# Altium schematic sheet HEADERS.SchDoc: Timing Controller Daughter Board; Memory & Crystal & Clock Synthesizer
size C; DrawnBy: A. Hood
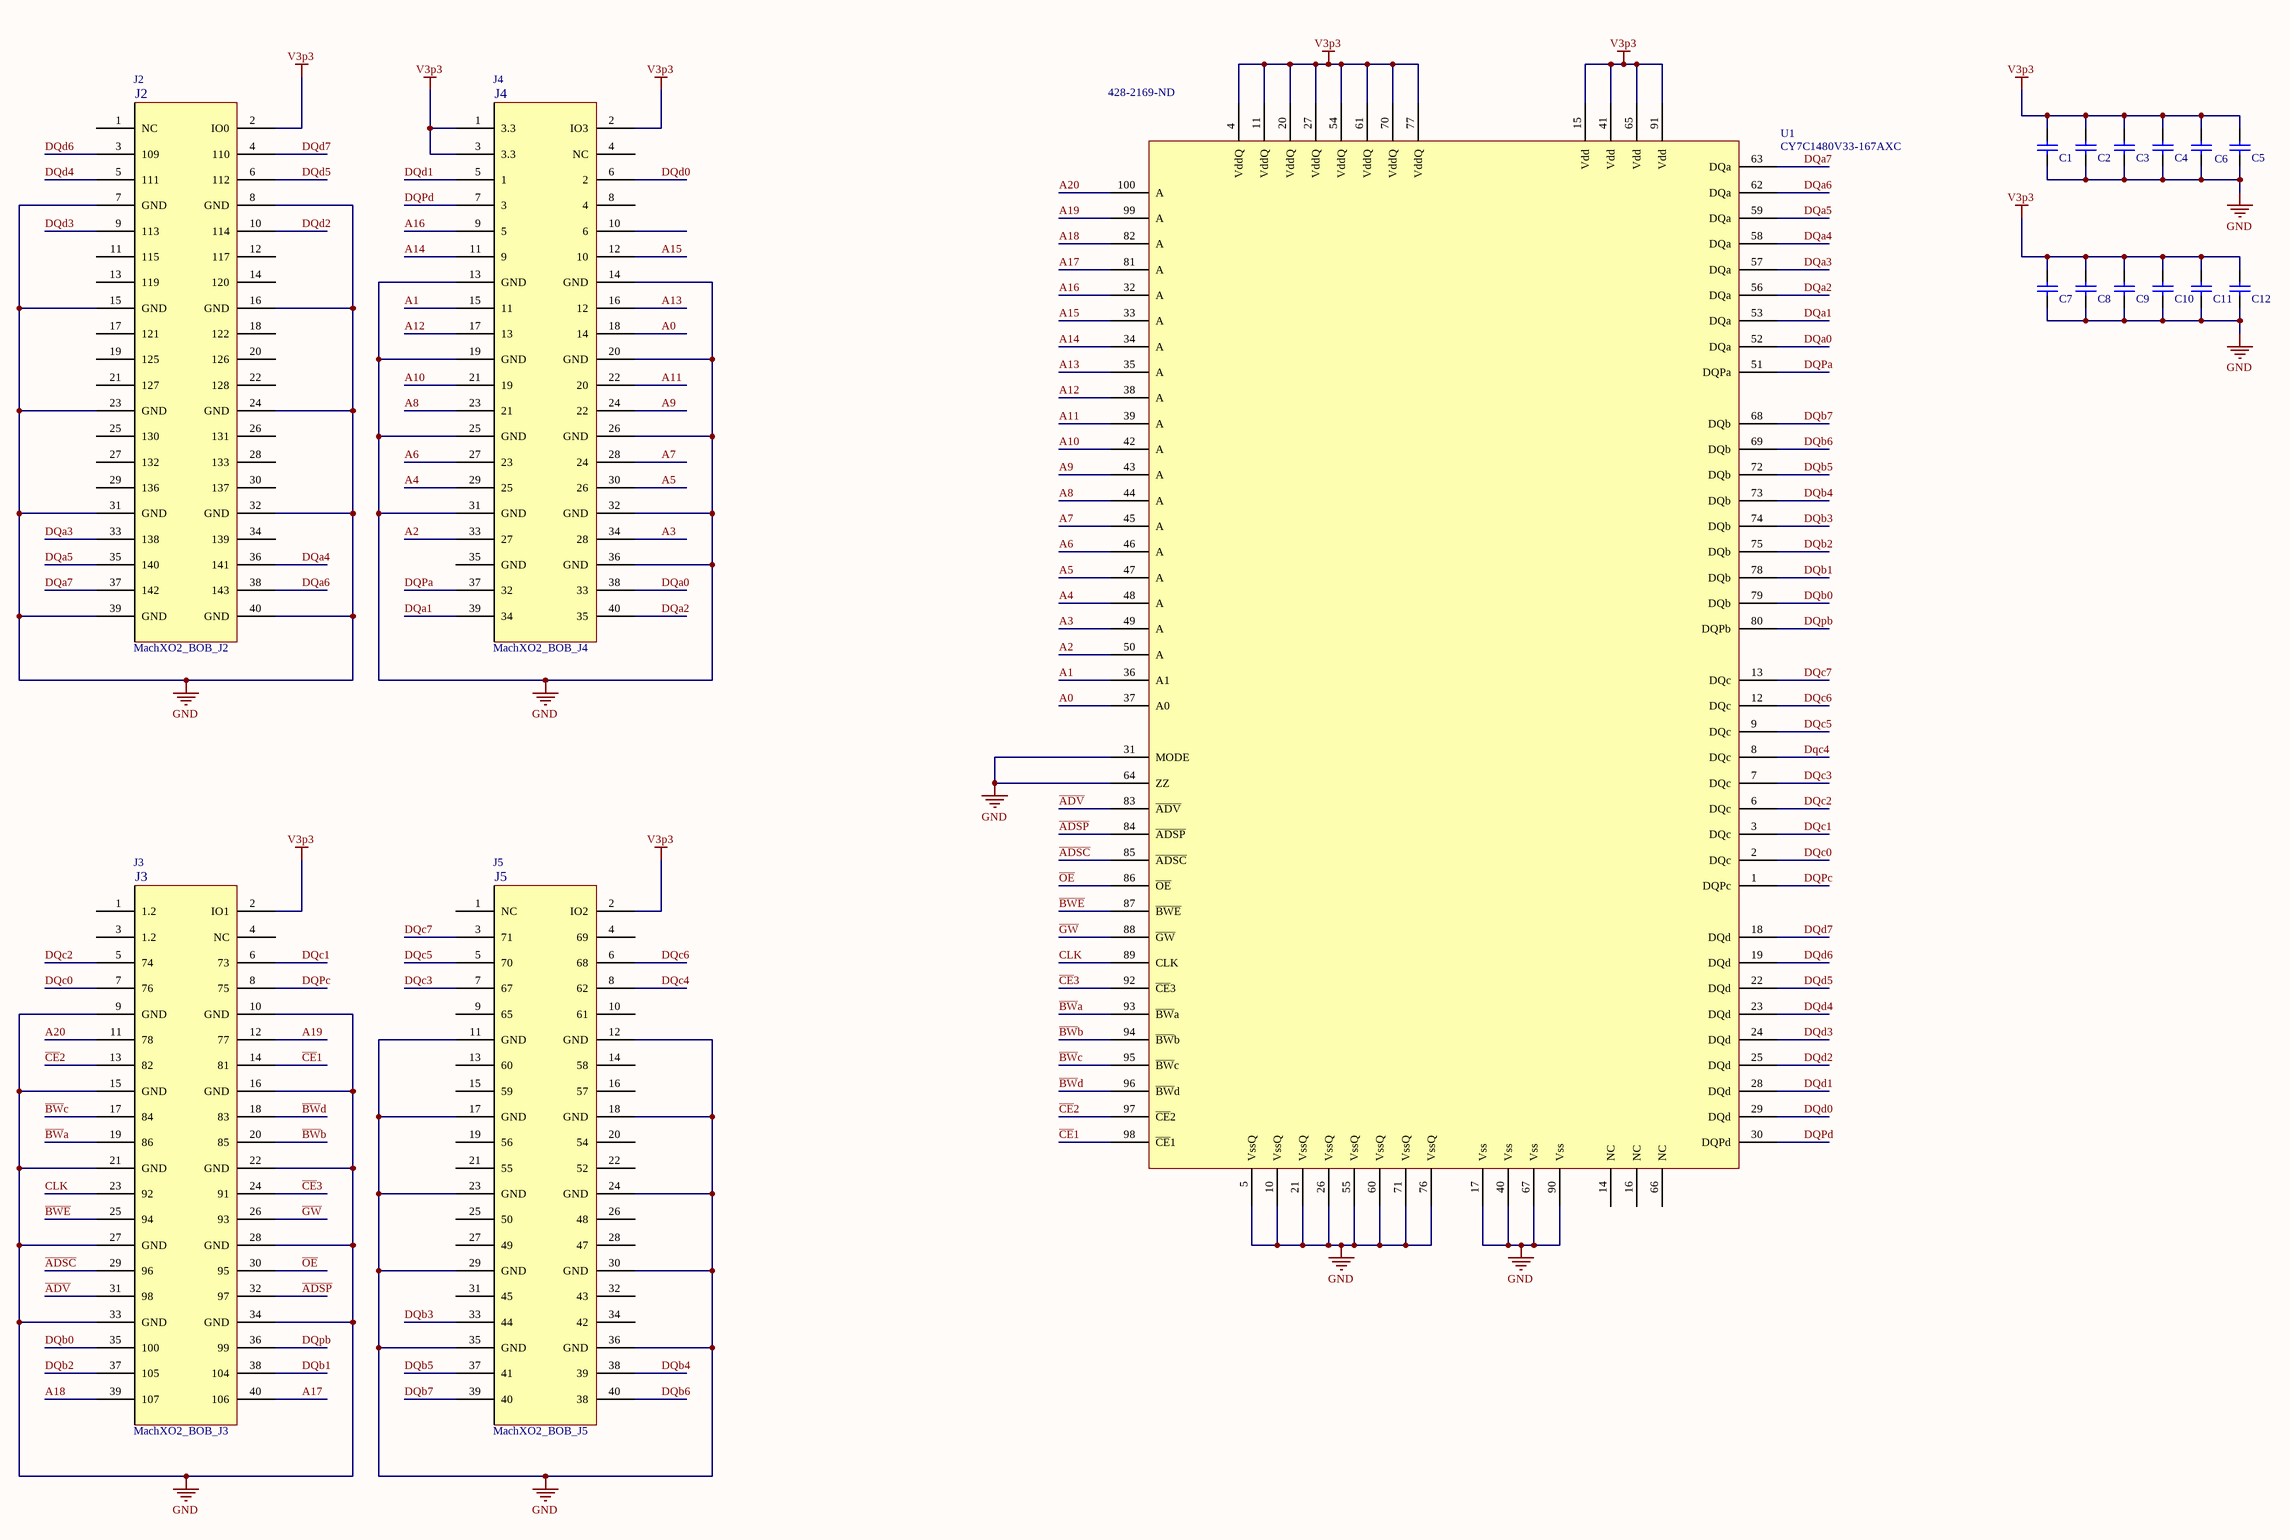
[diagram p0: HEADERS.SchDoc]

## Parts
C1  CAP 100nF 10V 0402(1005)  [CAPC0402(1005)60_L]  (value not drawn)
C2  CAP 100nF 10V 0402(1005)  [CAPC0402(1005)60_L]  (value not drawn)
C3  CAP 100nF 10V 0402(1005)  [CAPC0402(1005)60_L]  (value not drawn)
C4  CAP 100nF 10V 0402(1005)  [CAPC0402(1005)60_L]  (value not drawn)
C5  CAP 100nF 10V 0402(1005)  [CAPC0402(1005)60_L]  (value not drawn)
C6  CAP 100nF 10V 0402(1005)  [CAPC0402(1005)60_L]  (value not drawn)
C7  CAP 100nF 10V 0402(1005)  [CAPC0402(1005)60_L]  (value not drawn)
C8  CAP 100nF 10V 0402(1005)  [CAPC0402(1005)60_L]  (value not drawn)
C9  CAP 100nF 10V 0402(1005)  [CAPC0402(1005)60_L]  (value not drawn)
C10  CAP 100nF 10V 0402(1005)  [CAPC0402(1005)60_L]  (value not drawn)
C11  CAP 100nF 10V 0402(1005)  [CAPC0402(1005)60_L]  (value not drawn)
C12  CAP 100nF 10V 0402(1005)  [CAPC0402(1005)60_L]  (value not drawn)
J2  MachXO2_BOB_J2  [RECEPTACLE_25.4MM_20X2]
J3  MachXO2_BOB_J3  [RECEPTACLE_25.4MM_20X2]
J4  MachXO2_BOB_J4  [RECEPTACLE_25.4MM_20X2]
J5  MachXO2_BOB_J5  [RECEPTACLE_25.4MM_20X2]
U1  CY7C1480V33-167AXC  Supplier Part Number 1: 428-2169-ND  [TQFP65P1600X2200X140-100N]

## Nets
GND: C1.1 C2.1 C3.1 C4.1 C5.1 C6.1 C7.1 C8.1 C9.1 C10.1 C11.1 C12.1 J2.7(GND) J2.8(GND) J2.15(GND) J2.16(GND) J2.23(GND) J2.24(GND) J2.31(GND) J2.32(GND) J2.39(GND) J2.40(GND) J3.9(GND) J3.10(GND) J3.15(GND) J3.16(GND) J3.21(GND) J3.22(GND) J3.27(GND) J3.28(GND) J3.33(GND) J3.34(GND) J4.13(GND) J4.14(GND) J4.19(GND) J4.20(GND) J4.25(GND) J4.26(GND) J4.31(GND) J4.32(GND) J4.36(GND) J5.11(GND) J5.12(GND) J5.17(GND) J5.18(GND) J5.23(GND) J5.24(GND) J5.29(GND) J5.30(GND) J5.35(GND) J5.36(GND) U1.5(VssQ) U1.10(VssQ) U1.17(Vss) U1.21(VssQ) U1.26(VssQ) U1.31(MODE) U1.40(Vss) U1.55(VssQ) U1.60(VssQ) U1.64(ZZ) U1.67(Vss) U1.71(VssQ) U1.76(VssQ) U1.90(Vss)
V3p3: C1.2 C2.2 C3.2 C4.2 C5.2 C6.2 C7.2 C8.2 C9.2 C10.2 C11.2 C12.2 J2.2(IO0) J3.2(IO1) J4.1(3.3) J4.2(IO3) J4.3(3.3) J5.2(IO2) U1.4(VddQ) U1.11(VddQ) U1.15(Vdd) U1.20(VddQ) U1.27(VddQ) U1.41(Vdd) U1.54(VddQ) U1.61(VddQ) U1.65(Vdd) U1.70(VddQ) U1.77(VddQ) U1.91(Vdd)
A0: J4.18(14) U1.37(A0)
A1: J4.15(11) U1.36(A1)
A2: J4.33(27) U1.50(A)
A3: J4.34(28) U1.49(A)
A4: J4.29(25) U1.48(A)
A5: J4.30(26) U1.47(A)
A6: J4.27(23) U1.46(A)
A7: J4.28(24) U1.45(A)
A8: J4.23(21) U1.44(A)
A9: J4.24(22) U1.43(A)
A10: J4.21(19) U1.42(A)
A11: J4.22(20) U1.39(A)
A12: J4.17(13) U1.38(A)
A13: J4.16(12) U1.35(A)
A14: J4.11(9) U1.34(A)
A15: J4.12(10) U1.33(A)
A16: J4.9(5) U1.32(A)
A17: J3.40(106) U1.81(A)
A18: J3.39(107) U1.82(A)
A19: J3.12(77) U1.99(A)
A20: J3.11(78) U1.100(A)
~{ADSC}: J3.29(96) U1.85(~{ADSC})
~{ADSP}: J3.32(97) U1.84(~{ADSP})
~{ADV}: J3.31(98) U1.83(~{ADV})
~{BW}a: J3.19(86) U1.93(~{BW}a)
~{BW}b: J3.20(85) U1.94(~{BW}b)
~{BW}c: J3.17(84) U1.95(~{BW}c)
~{BW}d: J3.18(83) U1.96(~{BW}d)
~{BWE}: J3.25(94) U1.87(~{BWE})
~{CE}1: J3.14(81) U1.98(~{CE}1)
~{CE}2: J3.13(82) U1.97(~{CE}2)
~{CE}3: J3.24(91) U1.92(~{CE}3)
CLK: J3.23(92) U1.89(CLK)
DQa0: J4.38(33) U1.52(DQa)
DQa1: J4.39(34) U1.53(DQa)
DQa2: J4.40(35) U1.56(DQa)
DQa3: J2.33(138) U1.57(DQa)
DQa4: J2.36(141) U1.58(DQa)
DQa5: J2.35(140) U1.59(DQa)
DQa6: J2.38(143) U1.62(DQa)
DQa7: J2.37(142) U1.63(DQa)
DQb0: J3.35(100) U1.79(DQb)
DQb1: J3.38(104) U1.78(DQb)
DQb2: J3.37(105) U1.75(DQb)
DQb3: J5.33(44) U1.74(DQb)
DQb4: J5.38(39) U1.73(DQb)
DQb5: J5.37(41) U1.72(DQb)
DQb6: J5.40(38) U1.69(DQb)
DQb7: J5.39(40) U1.68(DQb)
DQc0: J3.7(76) U1.2(DQc)
DQc1: J3.6(73) U1.3(DQc)
DQc2: J3.5(74) U1.6(DQc)
DQc3: J5.7(67) U1.7(DQc)
Dqc4: J5.8(62) U1.8(DQc)
DQc5: J5.5(70) U1.9(DQc)
DQc6: J5.6(68) U1.12(DQc)
DQc7: J5.3(71) U1.13(DQc)
DQd0: J4.6(2) U1.29(DQd)
DQd1: J4.5(1) U1.28(DQd)
DQd2: J2.10(114) U1.25(DQd)
DQd3: J2.9(113) U1.24(DQd)
DQd4: J2.5(111) U1.23(DQd)
DQd5: J2.6(112) U1.22(DQd)
DQd6: J2.3(109) U1.19(DQd)
DQd7: J2.4(110) U1.18(DQd)
DQPa: J4.37(32) U1.51(DQPa)
DQpb: J3.36(99) U1.80(DQPb)
DQPc: J3.8(75) U1.1(DQPc)
DQPd: J4.7(3) U1.30(DQPd)
~{GW}: J3.26(93) U1.88(~{GW})
~{OE}: J3.30(95) U1.86(~{OE})

Not connected (* = marked no-connect by the designer): J2 1(NC) 11(115) 12(117) 13(119) 14(120) 17(121) 18(122) 19(125) 20(126) 21(127) 22(128) 25(130) 26(131) 27(132) 28(133) 29(136) 30(137) 34(139); J3 1(1.2) 3(1.2) 4(NC); J4 4(NC) 8(4) 10(6) 35(GND); J5 1(NC) 4(69) 9(65) 10(61) 13(60) 14(58) 15(59) 16(57) 19(56) 20(54) 21(55) 22(52) 25(50) 26(48) 27(49) 28(47) 31(45) 32(43) 34(42); U1 14(NC) 16(NC) 66(NC)

## Library data of the parts
C1-C12 = CMP-1034-02064-1: CAP 100nF 10V ±5% 0402 (1005 Metric) Thickness 0.6mm SMD; Case-EIA: 0402; Case-Metric: 1005; Max Thickness: 0.6 mm; Tolerance: ±5%; Value: 100nF; Rated Voltage: 10 V; Technology: SMT
U1 = CY7C1480V33-167AXC: Supplier 1: Digi-Key